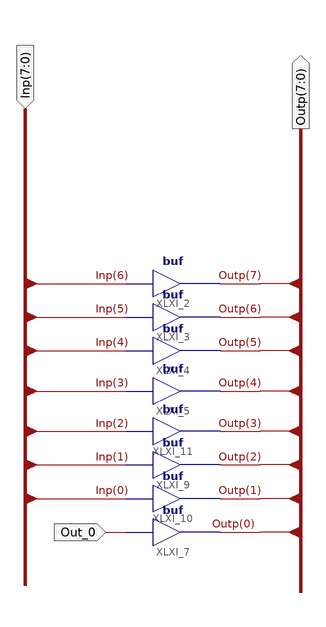
[diagram p0: schematic sheet 1]
// Xilinx ISE schematic Left_Shift_8Bit.sch (spartan3e) as structural Verilog: 8 symbols, 3 ports
module Left_Shift_8Bit (
  input  [7:0] Inp,
  input  Out_0,
  output [7:0] Outp
);

  buf XLXI_2 (Outp[7], Inp[6]);
  buf XLXI_3 (Outp[6], Inp[5]);
  buf XLXI_4 (Outp[5], Inp[4]);
  buf XLXI_5 (Outp[4], Inp[3]);
  buf XLXI_9 (Outp[2], Inp[1]);
  buf XLXI_10 (Outp[1], Inp[0]);
  buf XLXI_11 (Outp[3], Inp[2]);
  buf XLXI_7 (Outp[0], Out_0);
endmodule
